# Altium schematic sheet connectors.SchDoc: SIM868 Development Board
size 149 x 149 mm; SheetNumber: 14; SheetTotal: 14
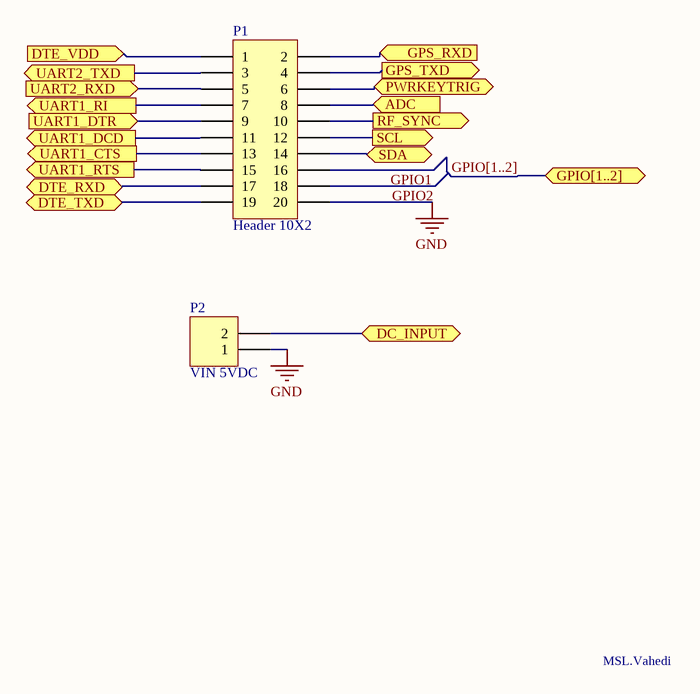
[diagram p0: connectors.SchDoc]

## Parts
P1  Header 10X2  [SULIN 20PIN]
P2  VIN 5VDC  [2PIN JACK]

## Ports
ADC (in), DC_INPUT (bidir), DTE_RXD (bidir), DTE_TXD (bidir), DTE_VDD (in), GPIO[1..2] (bidir), GPS_RXD (in), GPS_TXD (out), PWRKEYTRIG (bidir), RF_SYNC (out), SCL (out), SDA (bidir), UART1_CTS (out), UART1_DCD (out), UART1_DTR (in), UART1_RI (out), UART1_RTS (out), UART2_RXD (in), UART2_TXD (out)

## Nets
GND: P1.20 P2.1
ADC: P1.8 ; port ADC
DC_INPUT: P2.2 ; port DC_INPUT
DTE_RXD: P1.17 ; port DTE_RXD
DTE_TXD: P1.19 ; port DTE_TXD
DTE_VDD: P1.1 ; port DTE_VDD
GPIO1: P1.16
GPIO2: P1.18
GPS_RXD: P1.2 ; port GPS_RXD
GPS_TXD: P1.4 ; port GPS_TXD
PWRKEYTRIG: P1.6 ; port PWRKEYTRIG
RF_SYNC: P1.10 ; port RF_SYNC
SCL: P1.12 ; port SCL
SDA: P1.14 ; port SDA
UART1_CTS: P1.13 ; port UART1_CTS
UART1_DCD: P1.11 ; port UART1_DCD
UART1_DTR: P1.9 ; port UART1_DTR
UART1_RI: P1.7 ; port UART1_RI
UART1_RTS: P1.15 ; port UART1_RTS
UART2_RXD: P1.5 ; port UART2_RXD
UART2_TXD: P1.3 ; port UART2_TXD

## Buses and harness runs
bus GPIO[1..2] = port GPIO[1..2]

## Notes on the sheet
- MSL.Vahedi

## Library data of the parts
P1 = Header 10X2: Header, 10-Pin, Dual row; LatestRevisionDate: 17-Jul-2002; LatestRevisionNote: Re-released for DXP Platform.; Publisher: Altium Limited
P2 = Header 2: Header, 2-Pin; LatestRevisionDate: 17-Jul-2002; LatestRevisionNote: Re-released for DXP Platform.; Publisher: Altium Limited